# Altium schematic sheet 01-UART.SchDoc
size A4; DocumentNumber: 1; SheetNumber: 1; SheetTotal: 8
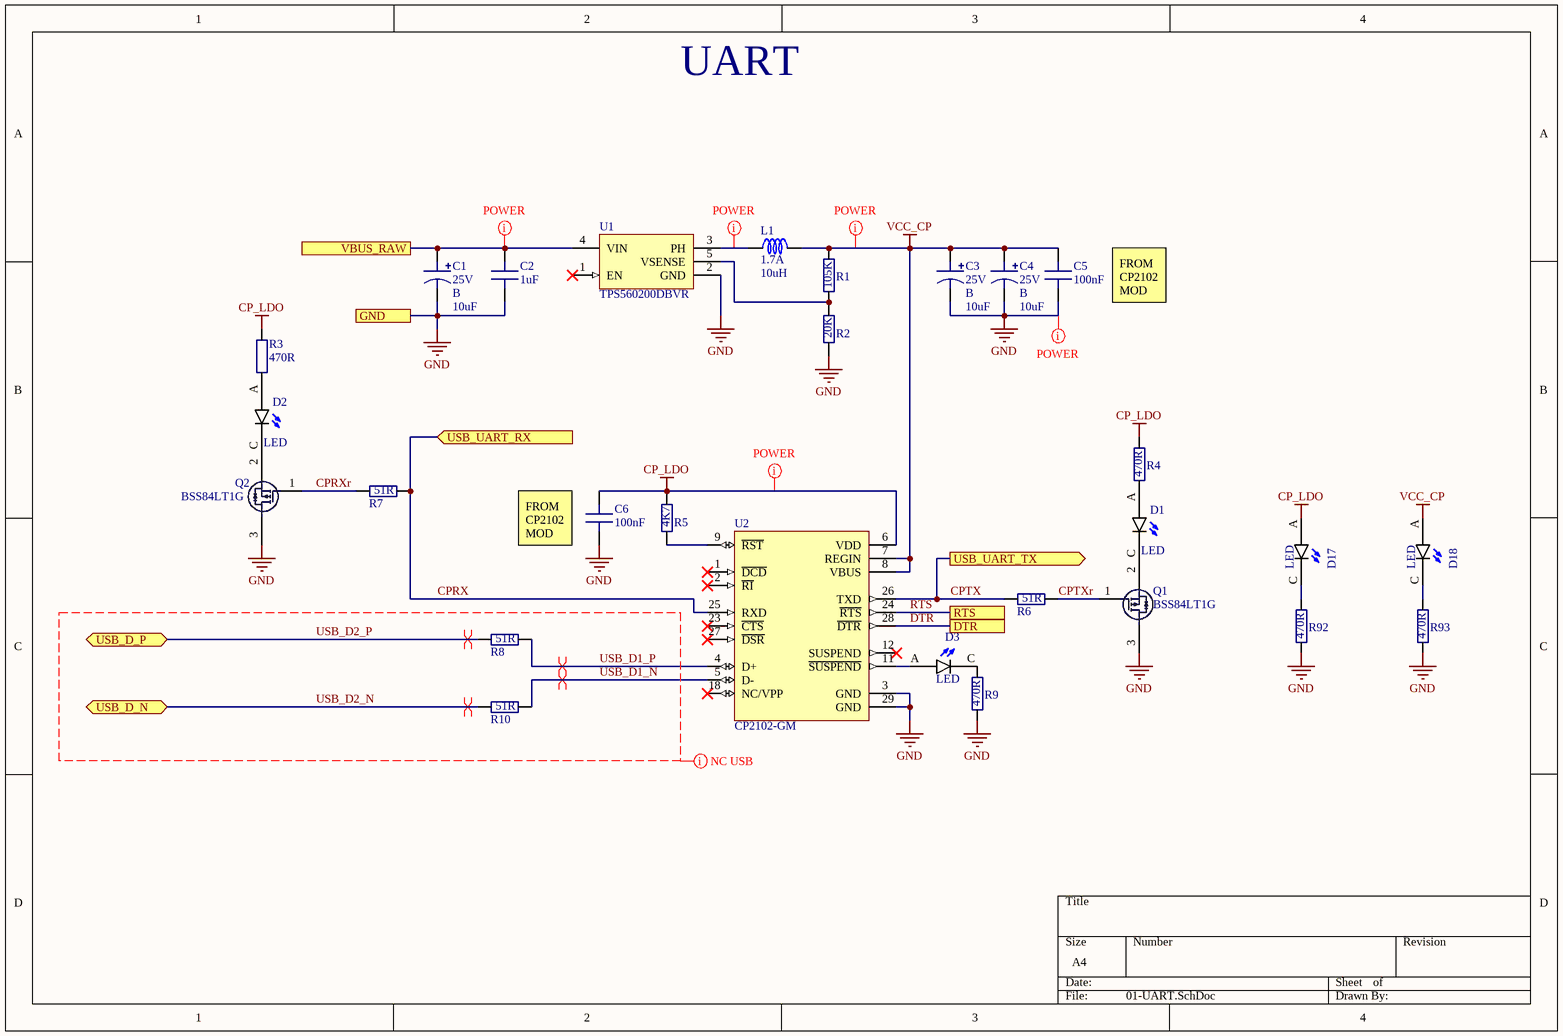
[diagram p0: 01-UART.SchDoc]

## Parts
C1  Voltage: 25V  Size: B  [CAP_SIZE_B]  (hidden comment: 10uF)
C2  1uF  [C0805]
C3  Voltage: 25V  Size: B  [CAP_SIZE_B]  (hidden comment: 10uF)
C4  Voltage: 25V  Size: B  [CAP_SIZE_B]  (hidden comment: 10uF)
C5  100nF  [C0603]
C6  100nF  [C0603]
D1  LED  [LED_0604]
D2  LED  [LED_0604]
D3  LED  [LED_0604]
D17  LED  [LED_0604]
D18  LED  [LED_0604]
L1  Current: 1.7A  Inductivity: 10uH  [L_CDRH6D28]  (hidden comment: *)
Q1  BSS84LT1G  [SOT-23_TO-236]
Q2  BSS84LT1G  [SOT-23_TO-236]
R1  Resistance: 105K  [R0603]
R2  Resistance: 20K  [R0603]
R3  Resistance: 470R  [R0603]
R4  Resistance: 470R  [R0603]
R5  Resistance: 4K7  [R0603]
R6  Resistance: 51R  [R0402]
R7  Resistance: 51R  [R0402]
R8  Resistance: 51R  [R0402]
R9  Resistance: 470R  [R0603]
R10  Resistance: 51R  [R0402]
R92  Resistance: 470R  [R0603]
R93  Resistance: 470R  [R0603]
U1  TPS560200DBVR  [SOT-23-5]
U2  CP2102-GM  [QFN50P500X500X100-29N]

## Ports
DTR, GND, RTS, USB_D_N (bidir), USB_D_P (bidir), USB_UART_RX (in), USB_UART_TX (out), VBUS_RAW

## Nets
CP_LDO: C6.2 D17.A R3.2 R4.2 R5.2 U2.6(VDD)
GND: C1.2 C2.1 C3.2 C4.2 C5.1 C6.1 Q1.3(D) Q2.3(D) R2.1 R9.1 R92.1 R93.1 U1.2(GND) U2.3(GND) U2.29(GND) ; port GND
VCC_CP: C3.1 C4.1 C5.2 D18.A L1.2 R1.2 U2.7(REGIN) U2.8(VBUS)
CPRX: R7.2 U2.25(RXD) ; port USB_UART_RX
CPRXr: Q2.1(G) R7.1
CPTX: R6.1 U2.26(TXD) ; port USB_UART_TX
CPTXr: Q1.1(G) R6.2
DTR: U2.28(~{DTR}) ; port DTR
RTS: U2.24(~{RTS}) ; port RTS
USB_D1_N: R10.2 U2.5(D-)
USB_D1_P: R8.2 U2.4(D+)
USB_D2_N: R10.1 ; port USB_D_N
USB_D2_P: R8.1 ; port USB_D_P
VBUS_RAW: C1.1 C2.2 U1.4(VIN) ; port VBUS_RAW
NetD1_A: D1.A R4.1
NetD1_C: D1.C Q1.2(S)
NetD2_A: D2.A R3.1
NetD2_C: D2.C Q2.2(S)
NetD3_A: D3.A U2.11(~{SUSPEND})
NetD3_C: D3.C R9.2
NetD17_C: D17.C R92.2
NetD18_C: D18.C R93.2
NetL1_1: L1.1 U1.3(PH)
NetR1_1: R1.1 R2.2 U1.5(VSENSE)
NetR5_1: R5.1 U2.9(~{RST})

Not connected (* = marked no-connect by the designer): U1 1(EN)*; U2 1(~{DCD})* 2(~{RI})* 12(SUSPEND)* 18(NC/VPP)* 23(~{CTS})* 27(~{DSR})*

## Layout directives
differential pair: USB_D1_N, USB_D1_P, USB_D2_N, USB_D2_P
net class USB: USB_D1_N, USB_D1_P, USB_D2_N, USB_D2_P
net class POWER_NET_CLASS: CP_LDO, GND, NetL1_1, VBUS_RAW, VCC_CP

## Notes on the sheet
- UART
- FROM
  CP2102
  MOD
- (near C6) FROM
  CP2102
  MOD

## Library data of the parts
C1 C3 C4 = CAP_B_10uF_25V: Tantalum capacitor; Capacity: 10uF; Value: 10uF
C2 = C0805_1uF_25V: Ceramic capacitor; Voltage: 25V; Capacity: 1uF; Size: 0805; Value: 1uF
C5 C6 = C0603_100nF_16V: Ceramic capacitor; Voltage: 16V; Capacity: 100nF; Size: 0603; Value: 100nF
D1-D3 D17 D18 = LED: Led General; MF: Dialight; MP: 598-8140-107F; SnapEDA_Link: https://www.snapeda.com/parts/598-8140-107F/Dialight/view-part/?ref=snap; Price: None; Availability: Unavailable; Package: 0805 Dialight; Value: *
L1 = L_CDRH6D28_10uH_1.7A: Inductor Generic; Value: *; Size: CDHR6D28; Url: http://www.kosmodrom.com.ua/el.php?name=CDRH6D28NP-100NC
Q1 Q2 = BSS84LT1G: Power MOSFET Single P-Channel SOT-23 -50 V, 10 
R1 = R0603_105K_1%: Resistor General; Tolerance: 1%; Size: 0603
R2 = R0603_20K_1%: Resistor General; Tolerance: 1%; Size: 0603
R3 R4 R9 R92 R93 = R0603_470R: Resistor General; Tolerance: 5%; Size: 0603
R5 = R0603_4K7: Resistor General; Tolerance: 5%; Size: 0603
R6-R8 R10 = R0402_51R: Resistor General; Tolerance: *; Size: 0402
U1 = TPS560200DBVR: TPS560200 4.5-V to 17-V Input, 500-mA Synchronous Step-Down Converter With Advanced Eco-Mode™
U2 = CP2102-GM: SINGLE-CHIP USB-TO-UART BRIDGE; MP: CP2102GM; MF: Silicon Labs; Availability: Unavailable; Package: VFQFN-28 Vishay Siliconix; Price: None; SnapEDA_Link: https://www.snapeda.com/parts/CP2102GM/Silicon%20Labs/view-part/?ref=snap; Value: *